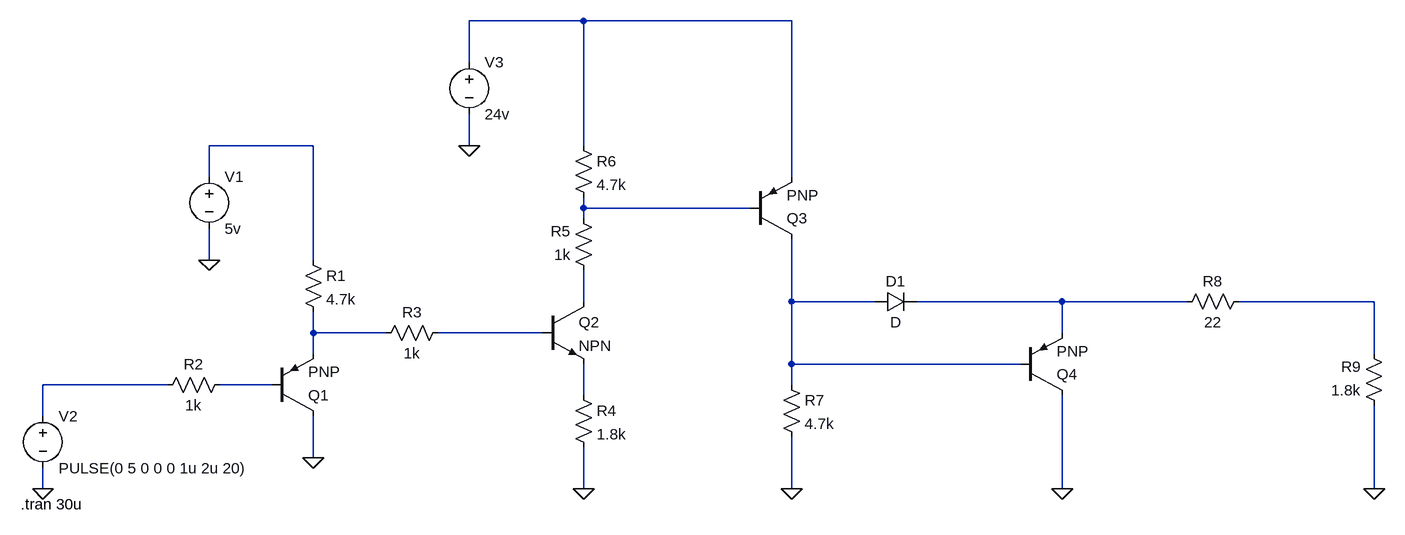
[diagram p0: schematic DriverMOS.asc]
DriverMOS.asc, the LTspice schematic file:
Version 4
SHEET 1 1828 680
WIRE 592 -448 416 -448
WIRE 912 -448 592 -448
WIRE 416 -384 416 -448
WIRE 176 -256 16 -256
WIRE 416 -256 416 -304
WIRE 592 -256 592 -448
WIRE 16 -208 16 -256
WIRE 912 -208 912 -448
WIRE 592 -160 592 -176
WIRE 848 -160 592 -160
WIRE 592 -144 592 -160
WIRE 16 -80 16 -128
WIRE 176 -80 176 -256
WIRE 592 -16 592 -64
WIRE 912 -16 912 -112
WIRE 1040 -16 912 -16
WIRE 1328 -16 1104 -16
WIRE 1520 -16 1328 -16
WIRE 1808 -16 1600 -16
WIRE 176 32 176 0
WIRE 288 32 176 32
WIRE 528 32 368 32
WIRE 1328 32 1328 -16
WIRE 176 64 176 32
WIRE 1808 64 1808 -16
WIRE 912 80 912 -16
WIRE 1264 80 912 80
WIRE -48 112 -240 112
WIRE 112 112 32 112
WIRE 912 112 912 80
WIRE 592 128 592 80
WIRE -240 160 -240 112
WIRE 176 224 176 160
WIRE -240 272 -240 240
WIRE 592 272 592 208
WIRE 912 272 912 192
WIRE 1328 272 1328 128
WIRE 1808 272 1808 144
FLAG 176 224 0
FLAG 16 -80 0
FLAG -240 272 0
FLAG 592 272 0
FLAG 416 -256 0
FLAG 912 272 0
FLAG 1328 272 0
FLAG 1808 272 0
SYMBOL pnp 112 160 M180
SYMATTR InstName Q1
SYMBOL res 160 -96 R0
SYMATTR InstName R1
SYMATTR Value 4.7k
SYMBOL res 48 96 R90
WINDOW 0 0 56 VBottom 2
WINDOW 3 32 56 VTop 2
SYMATTR InstName R2
SYMATTR Value 1k
SYMBOL res 384 16 R90
WINDOW 0 0 56 VBottom 2
WINDOW 3 32 56 VTop 2
SYMATTR InstName R3
SYMATTR Value 1k
SYMBOL voltage 16 -224 R0
WINDOW 123 0 0 Left 2
WINDOW 39 0 0 Left 2
SYMATTR InstName V1
SYMATTR Value 5v
SYMBOL voltage -240 144 R0
WINDOW 123 0 0 Left 2
WINDOW 39 0 0 Left 2
SYMATTR InstName V2
SYMATTR Value PULSE(0 5 0 0 0 1u 2u 20)
SYMBOL npn 528 -16 R0
SYMATTR InstName Q2
SYMBOL res 576 112 R0
SYMATTR InstName R4
SYMATTR Value 1.8k
SYMBOL res 608 -48 R180
WINDOW 0 36 76 Left 2
WINDOW 3 36 40 Left 2
SYMATTR InstName R5
SYMATTR Value 1k
SYMBOL res 576 -272 R0
SYMATTR InstName R6
SYMATTR Value 4.7k
SYMBOL voltage 416 -400 R0
WINDOW 123 0 0 Left 2
WINDOW 39 0 0 Left 2
SYMATTR InstName V3
SYMATTR Value 24v
SYMBOL pnp 848 -112 M180
SYMATTR InstName Q3
SYMBOL res 896 96 R0
SYMATTR InstName R7
SYMATTR Value 4.7k
SYMBOL diode 1040 0 R270
WINDOW 0 32 32 VTop 2
WINDOW 3 0 32 VBottom 2
SYMATTR InstName D1
SYMBOL pnp 1264 128 M180
SYMATTR InstName Q4
SYMBOL res 1616 -32 R90
WINDOW 0 0 56 VBottom 2
WINDOW 3 32 56 VTop 2
SYMATTR InstName R8
SYMATTR Value 22
SYMBOL res 1824 160 R180
WINDOW 0 36 76 Left 2
WINDOW 3 36 40 Left 2
SYMATTR InstName R9
SYMATTR Value 1.8k
TEXT -274 296 Left 2 !.tran 30u

The netlist it stands for:
* DriverMOS.asc
Q1 0 N011 N008 0 PNP
R1 N002 N008 4.7k
R2 N011 N010 1k
R3 N009 N008 1k
V1 N002 0 5v
V2 N010 0 PULSE(0 5 0 0 0 1u 2u 20)
Q2 N004 N009 N012 0 NPN
R4 N012 0 1.8k
R5 N004 N003 1k
R6 N001 N003 4.7k
V3 N001 0 24v
Q3 N005 N003 N001 0 PNP
R7 N005 0 4.7k
D1 N005 N006 D
Q4 0 N005 N006 0 PNP
R8 N007 N006 22
R9 0 N007 1.8k
.model D D
.lib standard.dio
.model NPN NPN
.model PNP PNP
.lib standard.bjt
.tran 30u
.backanno
.end